# Altium schematic sheet DTMF-FSK.SchDoc
size A
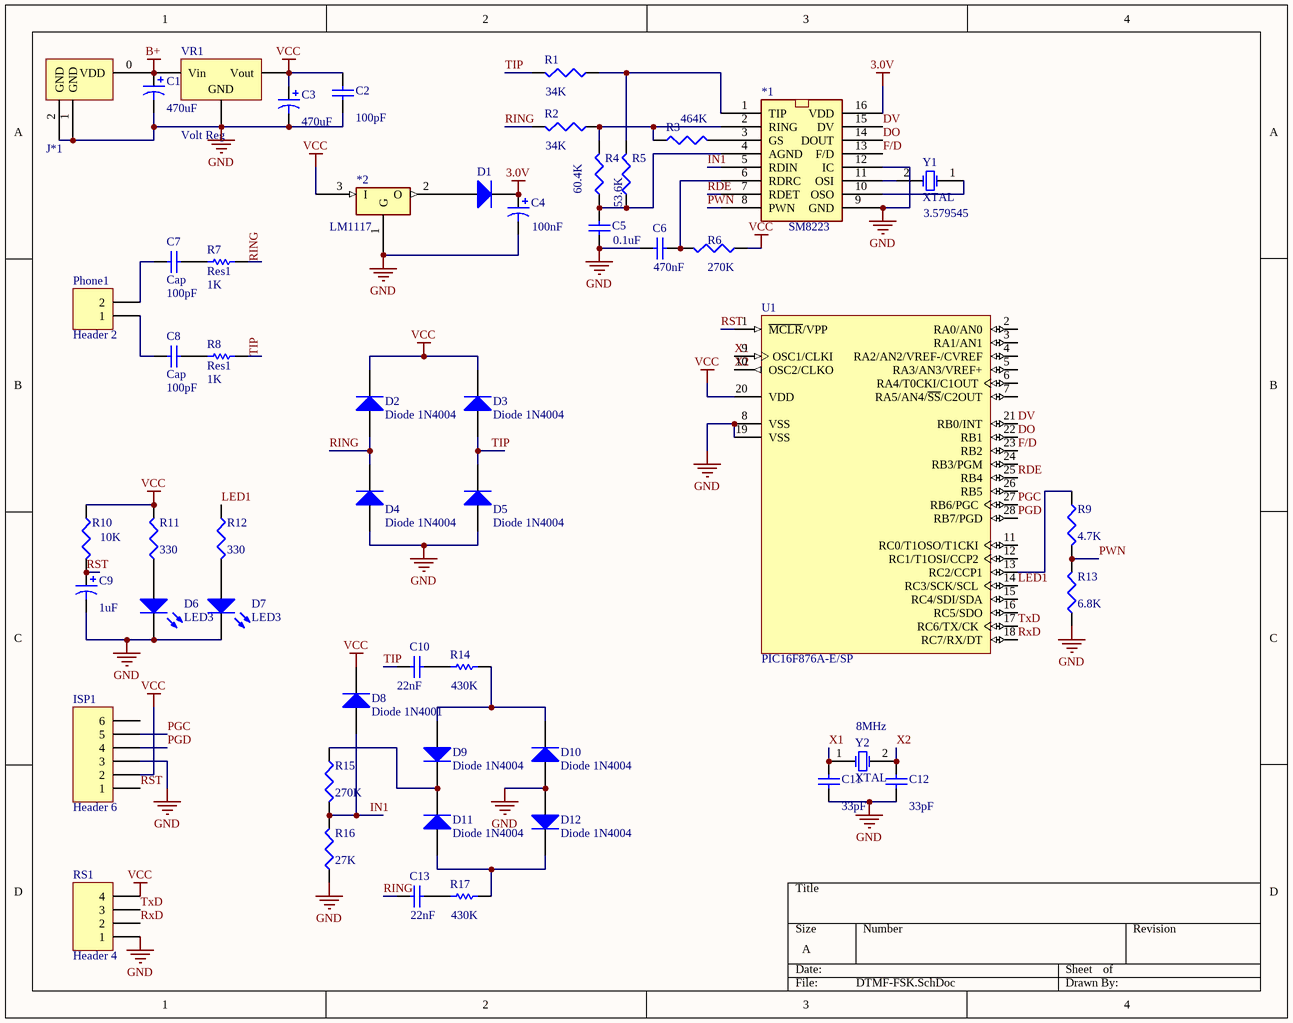
[diagram p0: DTMF-FSK.SchDoc]

## Parts
*1  SM8223  [NE016]
*2  LM1117  [LM1117]
C1  value 470uF  [CAPPR5-5x5]  (hidden comment: Cap Pol1)
C2  value 100pF  [CAPC1608L]  (hidden comment: Cap Semi)
C3  value 470uF  [CAPPR5-5x5]  (hidden comment: Cap Pol1)
C4  value 100nF  [CAPC4532L]  (hidden comment: Cap Pol3)
C5  value 0.1uF  [CAPC1608L]  (hidden comment: Cap Semi)
C6  value 470nF  [CAPC3216L]  (hidden comment: Cap Semi)
C7  Cap  value 100pF  [CAPR2.54-5.1x3.2]
C8  Cap  value 100pF  [CAPR2.54-5.1x3.2]
C9  value 1uF  [CAPC1608L]  (hidden comment: Cap Pol1)
C10  value 22nF  [CAPR2.54-5.1x3.2]  (hidden comment: Cap)
C11  value 33pF  [CAPC1608L]  (hidden comment: Cap Semi)
C12  value 33pF  [CAPC1608L]  (hidden comment: Cap Semi)
C13  value 22nF  [CAPR2.54-5.1x3.2]  (hidden comment: Cap)
D1  Diode  [DSO-C2/X3.3]  (value not drawn)
D2  Diode 1N4004  [DIO10.46-5.3x2.8]
D3  Diode 1N4004  [DIO10.46-5.3x2.8]
D4  Diode 1N4004  [DIO10.46-5.3x2.8]
D5  Diode 1N4004  [DIO10.46-5.3x2.8]
D6  LED3  [DSO-C2/D5.6]
D7  LED3  [DSO-C2/D5.6]
D8  Diode 1N4001  [DIO10.46-5.3x2.8]
D9  Diode 1N4004  [DIO10.46-5.3x2.8]
D10  Diode 1N4004  [DIO10.46-5.3x2.8]
D11  Diode 1N4004  [DIO10.46-5.3x2.8]
D12  Diode 1N4004  [DIO10.46-5.3x2.8]
ISP1  Header 6  [HDR1X6]
J*1  Jac_DC  [Jac_DC]  (value not drawn)
Phone1  Header 2  [HDR1X2]
R1  value 34K  [RESC1608L]  (hidden comment: Res3)
R2  value 34K  [RESC1608L]  (hidden comment: Res3)
R3  value 464K  [RESC1608L]  (hidden comment: Res3)
R4  value 60.4K  [RESC1608L]  (hidden comment: Res3)
R5  value 53.6K  [RESC1608L]  (hidden comment: Res3)
R6  value 270K  [RESC1608L]  (hidden comment: Res3)
R7  Res1  value 1K  [AXIAL-0.3]
R8  Res1  value 1K  [AXIAL-0.3]
R9  value 4.7K  [RESC1608L]  (hidden comment: Res3)
R10  value 10K  [RESC1608L]  (hidden comment: Res3)
R11  value 330  [RESC1608L]  (hidden comment: Res3)
R12  value 330  [RESC1608L]  (hidden comment: Res3)
R13  value 6.8K  [RESC1608L]  (hidden comment: Res3)
R14  value 430K  [AXIAL-0.3]  (hidden comment: Res1)
R15  value 270K  [RESC1608L]  (hidden comment: Res3)
R16  value 27K  [RESC1608L]  (hidden comment: Res3)
R17  value 430K  [AXIAL-0.3]  (hidden comment: Res1)
RS1  Header 4  [HDR1X4]
U1  PIC16F876A-E/SP  [SPDIP300-SP28]
VR1  Volt Reg  [TO-220]
Y1  XTAL  [BCY-W2/D3.1]
Y2  XTAL  [CAPR5-4X5]

## Nets
3.0V: *1.16(VDD) C4.1 D1.2(K)
B+: C1.1 J*1.0(VDD) VR1.1(Vin)
GND: *1.9(GND) *1.12(IC) *2.1(G) C1.2 C2.1 C3.2 C4.2 C5.1 C6.1 C9.2 C11.2 C12.2 D4.1(A) D5.1(A) D6.2(K) D7.2(K) D10.1(A) D12.1(A) ISP1.3 J*1.1(GND) J*1.2(GND) R13.1 R16.1 RS1.1 U1.8(VSS) U1.19(VSS) VR1.2(GND)
VCC: *2.3(I) C2.2 C3.1 D2.2(K) D3.2(K) D8.2(K) ISP1.2 R6.1 R10.1 R11.2 RS1.4 U1.20(VDD) VR1.3(Vout)
DO: *1.14(DOUT) U1.22(RB1)
DV: *1.15(DV) U1.21(RB0/INT)
F/D: *1.13(F/D) U1.23(RB2)
IN1: *1.5(RDIN) D8.1(A) R15.2 R16.2
LED1: R12.1 U1.14(RC3/SCK/SCL)
PGC: ISP1.5 U1.27(RB6/PGC)
PGD: ISP1.4 U1.28(RB7/PGD)
PWN: *1.8(PWN) R9.2 R13.2
RDE: *1.7(RDET) U1.25(RB4)
RING: C13.1 D2.1(A) D4.2(K) R2.2 R7.1
RST: C9.1 ISP1.1 R10.2 U1.1(~{MCLR}/VPP)
RxD: RS1.2 U1.18(RC7/RX/DT)
TIP: C10.1 D3.1(A) D5.2(K) R1.2 R8.1
TxD: RS1.3 U1.17(RC6/TX/CK)
X1: C11.1 U1.9(OSC1/CLKI) Y2.1(OSC1)
X2: C12.1 U1.10(OSC2/CLKO) Y2.2(OSC2)
Net*1_1: *1.1(TIP) R1.1 R5.2
Net*1_2: *1.2(RING) R2.1 R3.1 R4.2
Net*1_3: *1.3(GS) R3.2
Net*1_4: *1.4(AGND) C5.2 R4.1 R5.1
Net*1_6: *1.6(RDRC) C6.2 R6.2
Net*1_10: *1.10(OSO) Y1.1(OSC1)
Net*1_11: *1.11(OSI) Y1.2(OSC2)
Net*2_2: *2.2(O) D1.1(A)
NetC7_1: C7.1 R7.2
NetC7_2: C7.2 Phone1.2
NetC8_1: C8.1 R8.2
NetC8_2: C8.2 Phone1.1
NetC10_2: C10.2 R14.2
NetC13_2: C13.2 R17.2
NetD6_1: D6.1(A) R11.1
NetD7_1: D7.1(A) R12.2
NetD9_1: D9.1(A) D10.2(K) R14.1
NetD9_2: D9.2(K) D11.2(K) R15.1
NetD11_1: D11.1(A) D12.2(K) R17.1
NetR9_1: R9.1 U1.13(RC2/CCP1)

Not connected (* = marked no-connect by the designer): ISP1 6; U1 2(RA0/AN0) 3(RA1/AN1) 4(RA2/AN2/VREF-/CVREF) 5(RA3/AN3/VREF+) 6(RA4/T0CKI/C1OUT) 7(RA5/AN4/~{SS}/C2OUT) 11(RC0/T1OSO/T1CKI) 12(RC1/T1OSI/CCP2) 15(RC4/SDI/SDA) 16(RC5/SDO) 24(RB3/PGM) 26(RB5)

## Notes on the sheet
- (in symbol XTAL) 8MHz; 3.579545

## Library data of the parts
C1 C3 C9 = Cap Pol1: Polarized Capacitor (Radial); Published: 8-Jun-2000; LatestRevisionDate: 17-Jul-2002; LatestRevisionNote: Re-released for DXP Platform.; PackageReference: RB7.6-15; Publisher: Altium Limited
C2 C5 C6 C11 C12 = Cap Semi: Capacitor (Semiconductor SIM Model); Published: 8-Jun-2000; LatestRevisionDate: 29-May-2009; LatestRevisionNote: IPC-7351 Footprint Added.; PackageReference: C1206; Publisher: Altium Limited; PackageDescription: Chip Capacitor
C4 = Cap Pol3: Polarized Capacitor (Surface Mount); Published: 8-Jun-2000; LatestRevisionDate: 29-May-2009; LatestRevisionNote: IPC-7351 Footprint Added.; PackageReference: C0805; Publisher: Altium Limited; PackageDescription: Chip Capacitor
C7 C8 C10 C13 = Cap: Capacitor; Published: 8-Jun-2000; LatestRevisionDate: 17-Jul-2002; LatestRevisionNote: Re-released for DXP Platform.; PackageReference: RAD-0.3; Publisher: Altium Limited
D1 = Diode: Default Diode; Published: 8-Jun-2000; LatestRevisionDate: 17-Jul-2002; LatestRevisionNote: Re-released for DXP Platform.; PackageVersion: Sep-1996; PackageReference: SMC; Publisher: Altium Limited; Code_JEDEC: DO-214-AB
D2-D5 D9-D12 = Diode 1N4004: 1 Amp General Purpose Rectifier; Published: 8-Jun-2000; LatestRevisionDate: 17-Jul-2002; LatestRevisionNote: Re-released for DXP Platform.; DatasheetVersion: 1998; PackageVersion: Aug-1999; PackageReference: DO-41; Publisher: Altium Limited; Code_JEDEC: DO-204-AL; ComponentLink1Description: Manufacturer Link; ComponentLink1URL: http://www.fairchildsemi.com/; ComponentLink2Description: Datasheet; ComponentLink2URL: http://www.fairchildsemi.com/ds/1N%2F1N4001.pdf
D6 D7 = LED3: Typical BLUE SiC LED; Published: 8-Jun-2000; LatestRevisionDate: 17-Dec-2003; LatestRevisionNote: PCB Footprint replaced.; DatasheetVersion: 16-Apr-2002; PackageVersion: 16-Apr-2002; PackageReference: 3.5X2.8X1.9; Publisher: Altium Limited
D8 = Diode 1N4001: 1 Amp General Purpose Rectifier; Published: 8-Jun-2000; LatestRevisionDate: 17-Jul-2002; LatestRevisionNote: Re-released for DXP Platform.; DatasheetVersion: 1998; PackageVersion: Aug-1999; PackageReference: DO-41; Publisher: Altium Limited; Code_JEDEC: DO-204-AL; ComponentLink1Description: Manufacturer Link; ComponentLink1URL: http://www.fairchildsemi.com/; ComponentLink2Description: Datasheet; ComponentLink2URL: http://www.fairchildsemi.com/ds/1N%2F1N4001.pdf
ISP1 = Header 6: Header, 6-Pin; LatestRevisionDate: 17-Jul-2002; LatestRevisionNote: Re-released for DXP Platform.; Publisher: Altium Limited
Phone1 = Header 2: Header, 2-Pin; LatestRevisionDate: 17-Jul-2002; LatestRevisionNote: Re-released for DXP Platform.; Publisher: Altium Limited
R1-R6 R9-R13 R15 R16 = Res3: Resistor; Published: 8-Jun-2000; LatestRevisionDate: 29-May-2009; LatestRevisionNote: IPC-7351 Footprint Added.; PackageReference: J1-0603; Publisher: Altium Limited; PackageDescription: Chip Resistor
R7 R8 R14 R17 = Res1: Resistor; Published: 8-Jun-2000; LatestRevisionDate: 17-Jul-2002; LatestRevisionNote: Re-released for DXP Platform.; PackageReference: AXIAL-0.3; Publisher: Altium Limited
RS1 = Header 4: Header, 4-Pin; LatestRevisionDate: 17-Jul-2002; LatestRevisionNote: Re-released for DXP Platform.; Publisher: Altium Limited
U1 = PIC16F876A-E/SP: Enhanced FLASH Microcontroller, 8K (x14-Bit words) FLASH, 368 Bytes RAM, 28-Pin PDIP 300mil, Standard VDD Range, Extended Temperature; ComponentAvailability: Unknown. Contact manufacturer to determine status.; FirstPublished: 11-Oct-2004; LatestRevisionDate: 29-Jan-2009; LatestRevisionNote: Sch. layout revised. 3D Model Removed.; DatasheetVersion: revB, Oct-2003; PackageVersion: revBB, Aug-2009; PackageReference: SPDIP300-SP28; Publisher: Altium Limited; PackageDescription: 28-Lead Skinny Plastic Dual In-Line (SP) - 300 mil Body [SPDIP]; Supplier 1: Digi-Key; Supplier Part Number 1: PIC16F876A-E/SP-ND; Supplier 2: Farnell; Supplier Part Number 2: 1712091; Supplier 3: Newark; Supplier Part Number 3: 92C4679; ComponentLink1Description: Datasheet; ComponentLink1URL: http://ww1.microchip.com/downloads/en/DeviceDoc/39582b.pdf; ComponentLink2Description: Packaging Specification; ComponentLink2URL: http://www.microchip.com/stellent/groups/techpub_sg/documents/packagingspec/en012702.pdf; ComponentLink3Description: Microchip.com Home; ComponentLink3URL: http://www.microchip.com/
VR1 = Volt Reg: Voltage Regulator; Published: 24-Mar-1999; LatestRevisionDate: 29-May-2009; LatestRevisionNote: IPC-7351 Footprint Added.; PackageReference: D2PAK; Publisher: Altium Limited; PackageDescription: 3-Pin Transistor Outline Package 2.54 mm Pitch, 15.1 mm Lead Span
Y1 Y2 = XTAL: Crystal Oscillator; Published: 8-Jun-2000; LatestRevisionDate: 17-Jul-2002; LatestRevisionNote: Re-released for DXP Platform.; PackageReference: R38; Publisher: Altium Limited